# EAGLE design IC Adapter 2x1x24 (EAGLE 9.6.2)
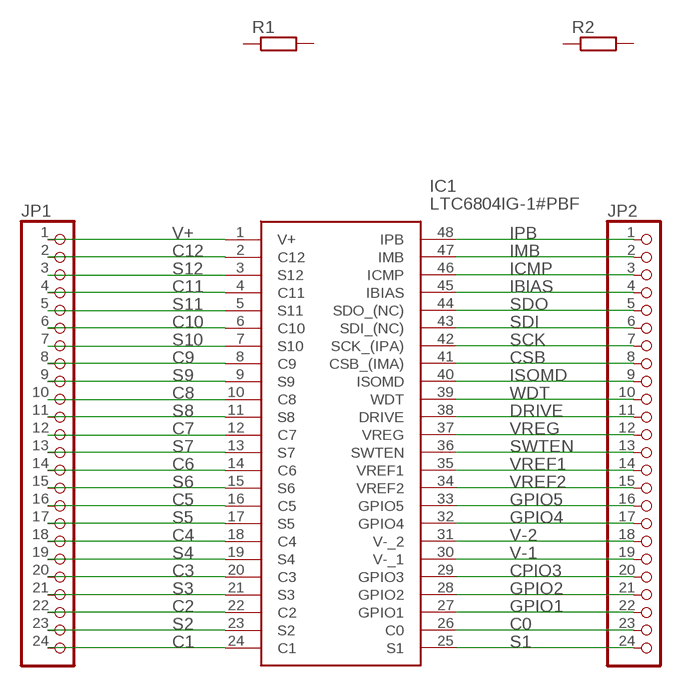
[diagram p0: schematic, sheet 1]

## Parts
IC1  LTC6804IG-1#PBF  [SOP50P780X200-48N]
JP1  PINHD-1X24  [1X24]
JP2  PINHD-1X24  [1X24]
R1  R-EU_R1210  [R1210]
R2  R-EU_R1210  [R1210]

## Nets
C0: IC1.26(C0) JP2.23
C1: IC1.24(C1) JP1.24
C2: IC1.22(C2) JP1.22
C3: IC1.20(C3) JP1.20
C4: IC1.18(C4) JP1.18
C5: IC1.16(C5) JP1.16
C6: IC1.14(C6) JP1.14
C7: IC1.12(C7) JP1.12
C8: IC1.10(C8) JP1.10
C9: IC1.8(C9) JP1.8
C10: IC1.6(C10) JP1.6
C11: IC1.4(C11) JP1.4
C12: IC1.2(C12) JP1.2
CPIO3: IC1.29(GPIO3) JP2.20
CSB: IC1.41(CSB_(IMA)) JP2.8
DRIVE: IC1.38(DRIVE) JP2.11
GPIO1: IC1.27(GPIO1) JP2.22
GPIO2: IC1.28(GPIO2) JP2.21
GPIO4: IC1.32(GPIO4) JP2.17
GPIO5: IC1.33(GPIO5) JP2.16
IBIAS: IC1.45(IBIAS) JP2.4
ICMP: IC1.46(ICMP) JP2.3
IMB: IC1.47(IMB) JP2.2
IPB: IC1.48(IPB) JP2.1
ISOMD: IC1.40(ISOMD) JP2.9
S1: IC1.25(S1) JP2.24
S2: IC1.23(S2) JP1.23
S3: IC1.21(S3) JP1.21
S4: IC1.19(S4) JP1.19
S5: IC1.17(S5) JP1.17
S6: IC1.15(S6) JP1.15
S7: IC1.13(S7) JP1.13
S8: IC1.11(S8) JP1.11
S9: IC1.9(S9) JP1.9
S10: IC1.7(S10) JP1.7
S11: IC1.5(S11) JP1.5
S12: IC1.3(S12) JP1.3
SCK: IC1.42(SCK_(IPA)) JP2.7
SDI: IC1.43(SDI_(NC)) JP2.6
SDO: IC1.44(SDO_(NC)) JP2.5
SWTEN: IC1.36(SWTEN) JP2.13
V+: IC1.1(V+) JP1.1
V-1: IC1.30(V-_1) JP2.19
V-2: IC1.31(V-_2) JP2.18
VREF1: IC1.35(VREF1) JP2.14
VREF2: IC1.34(VREF2) JP2.15
VREG: IC1.37(VREG) JP2.12
WDT: IC1.39(WDT) JP2.10
Unconnected: R1.1 R1.2 R2.1 R2.2

## Library data of the parts
IC1 = SamacSys_Parts:LTC6804IG-1#PBF: Multicell Battery Monitors, 0V - 5V Source: Datasheet <http://cds.linear.com/docs/en/datasheet/680412fb.pdf>; DESCRIPTION: Multicell Battery Monitors, 0V - 5V; HEIGHT: 2mm; MANUFACTURER_NAME: Linear Technology; MANUFACTURER_PART_NUMBER: LTC6804IG-1#PBF; MOUSER_PART_NUMBER: 584-LTC6804IG-1#PBF; MOUSER_PRICE-STOCK: https://www.mouser.co.uk/ProductDetail/Analog-Devices-Linear-Technology/LTC6804IG-1PBF?qs=hVkxg5c3xu%2FdtwBTq6c3xw%3D%3D
JP1 JP2 = pinhead:PINHD-1X24: PIN HEADER
R1 R2 = rcl:R-EU_: RESISTOR, European symbol

## Board
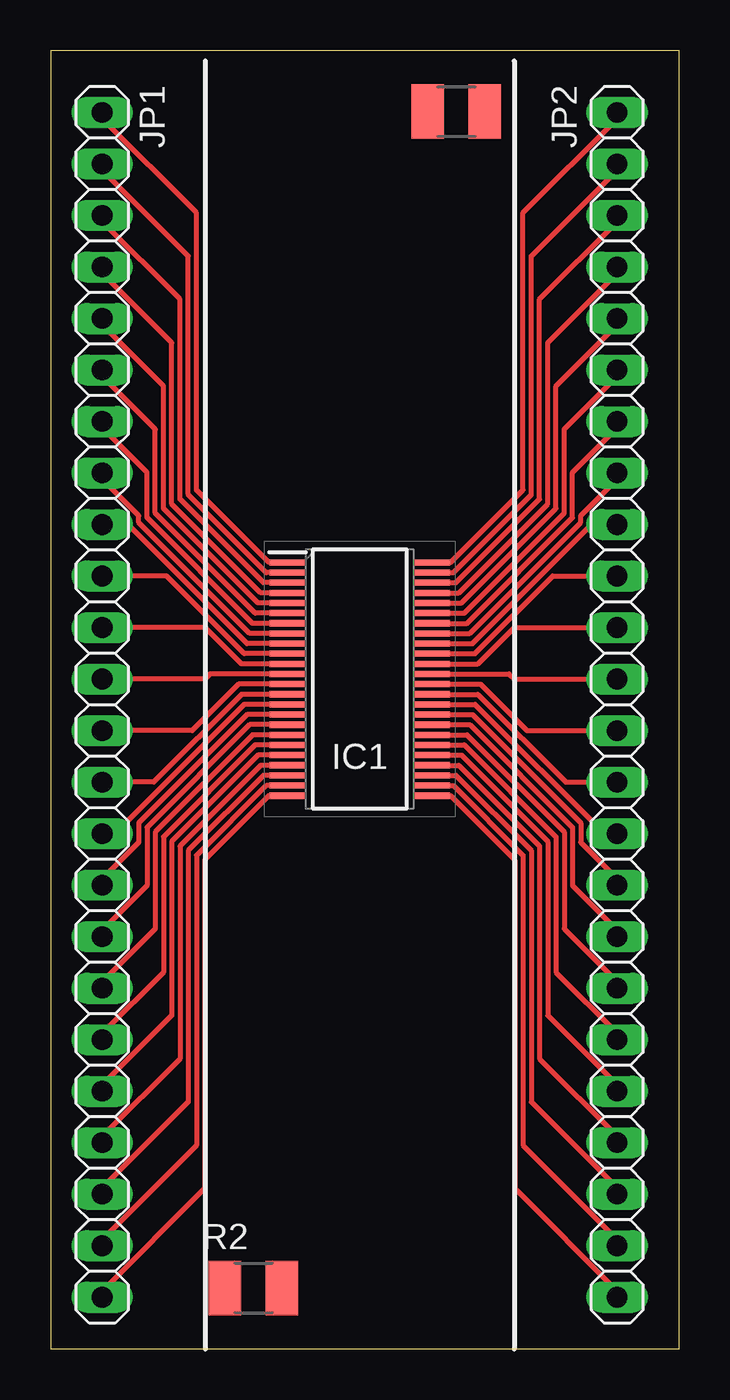
[diagram p1: board, top side]

Size 31 x 64 mm. Coordinates in mm from the lower left corner, seen from the top.
Outline: 0,0 31,0 31,64 0,64 0,0
Copper layers (1*16): Top 0.035mm / dielectric 1.5mm / Bottom 0.035mm
Design rules "default *": minimum track width 10mil, minimum drill 0.35mm, track to track 6mil, track to pad 6mil, pad to pad 6mil, via to via 6mil, smd to smd 6mil, copper to edge 40mil, drill to drill 6mil, minimum pad ring 10mil, minimum via ring 8mil, stop-mask expansion 4mil, vias tented up to drill 20mil, thermal gap 10mil

### Footprints (pad centres in the part's own frame; a part is rotated, then mirrored left to right if it is on the bottom)
SOP50P780X200-48N = smd 1.8 x 0.3: 1 -3.55,5.75; 2 -3.55,5.25; 3 -3.55,4.75; 4 -3.55,4.25; 5 -3.55,3.75; 6 -3.55,3.25; 7 -3.55,2.75; 8 -3.55,2.25; 9 -3.55,1.75; 10 -3.55,1.25; 11 -3.55,0.75; 12 -3.55,0.25; 13 -3.55,-0.25; 14 -3.55,-0.75; 15 -3.55,-1.25; 16 -3.55,-1.75; 17 -3.55,-2.25; 18 -3.55,-2.75; 19 -3.55,-3.25; 20 -3.55,-3.75; 21 -3.55,-4.25; 22 -3.55,-4.75; 23 -3.55,-5.25; 24 -3.55,-5.75; 25 3.55,-5.75; 26 3.55,-5.25; 27 3.55,-4.75; 28 3.55,-4.25; 29 3.55,-3.75; 30 3.55,-3.25; 31 3.55,-2.75; 32 3.55,-2.25; 33 3.55,-1.75; 34 3.55,-1.25; 35 3.55,-0.75; 36 3.55,-0.25; 37 3.55,0.25; 38 3.55,0.75; 39 3.55,1.25; 40 3.55,1.75; 41 3.55,2.25; 42 3.55,2.75; 43 3.55,3.25; 44 3.55,3.75; 45 3.55,4.25; 46 3.55,4.75; 47 3.55,5.25; 48 3.55,5.75
1X24 = drill 1.016 long: 1 -29.21,0; 2 -26.67,0; 3 -24.13,0; 4 -21.59,0; 5 -19.05,0; 6 -16.51,0; 7 -13.97,0; 8 -11.43,0; 9 -8.89,0; 10 -6.35,0; 11 -3.81,0; 12 -1.27,0; 13 1.27,0; 14 3.81,0; 15 6.35,0; 16 8.89,0; 17 11.43,0; 18 13.97,0; 19 16.51,0; 20 19.05,0; 21 21.59,0; 22 24.13,0; 23 26.67,0; 24 29.21,0
R1210 = smd 1.6 x 2.7: 1 -1.4,0; 2 1.4,0

### Placement (x,y rotation side)
IC1  15.24,33.02 0 top
JP1  2.54,31.75 270 top
JP2  27.94,31.75 270 top
R1  20,61 0 top
R2  10,3 0 top

### Tracks (layer width: path | path; a pad name or v marks a point on that pad's centre or on a via)
C0
  Top 0.254: IC1.26 19.86,27.77 23.29,24.33 23.29,10.03 27.94,5.38 JP2.23
C1
  Top 0.254: IC1.24 10.76,27.27 7.59,24.11 7.59,7.9 2.54,2.85 JP1.24
C2
  Top 0.254: IC1.22 10.49,28.27 6.78,24.56 6.78,12.17 2.54,7.92 JP1.22
C3
  Top 0.254: IC1.20 10.22,29.27 5.97,25.02 5.97,16.43 2.54,13.01 JP1.20
C4
  Top 0.254: IC1.18 9.95,30.27 5.16,25.48 5.16,20.7 2.54,18.09 JP1.18
C5
  Top 0.254: IC1.16 9.68,31.27 4.34,25.93 4.34,24.97 2.54,23.16 JP1.16
C6
  Top 0.254: IC1.14 9.41,32.27 5.08,27.94 JP1.14
C7
  Top 0.254: IC1.12 7.87,33.27 7.62,33.02 JP1.12
C8
  Top 0.254: IC1.10 9.54,34.27 5.71,38.1 JP1.10
C9
  Top 0.254: IC1.8 9.81,35.27 4.34,40.74 4.34,41.07 2.54,42.88 JP1.8
C10
  Top 0.254: IC1.6 10.09,36.27 5.16,41.2 5.16,45.34 2.54,47.95 JP1.6
C11
  Top 0.254: IC1.4 10.36,37.27 5.97,41.66 5.97,49.61 2.54,53.03 JP1.4
C12
  Top 0.254: IC1.2 10.62,38.27 6.78,42.11 6.78,53.87 2.54,58.12 JP1.2
CPIO3
  Top 0.254: IC1.29 20.26,29.27 24.51,25.02 24.51,16.43 27.94,13.01 JP2.20
CSB
  Top 0.254: IC1.41 20.66,35.27 26.14,40.74 26.14,41.07 27.94,42.88 JP2.8
DRIVE
  Top 0.254: IC1.38 21.07,33.77 22.86,35.56 JP2.11
GPIO1
  Top 0.254: IC1.27 19.99,28.27 23.7,24.56 23.7,12.17 27.94,7.92 JP2.22
GPIO2
  Top 0.254: IC1.28 20.12,28.77 24.11,24.79 24.11,14.3 27.94,10.46 JP2.21
GPIO4
  Top 0.254: IC1.32 20.66,30.77 25.73,25.7 25.73,22.84 27.94,20.62 JP2.17
GPIO5
  Top 0.254: IC1.33 20.8,31.27 26.14,25.93 26.14,24.97 27.94,23.16 JP2.16
IBIAS
  Top 0.254: IC1.45 20.12,37.27 24.51,41.66 24.51,49.61 27.94,53.03 JP2.4
ICMP
  Top 0.254: IC1.46 19.99,37.77 24.11,41.88 24.11,51.74 27.94,55.58 JP2.3
IMB
  Top 0.254: IC1.47 19.86,38.27 23.7,42.11 23.7,53.87 27.94,58.12 JP2.2
IPB
  Top 0.254: IC1.48 19.72,38.77 23.29,42.34 23.29,56.01 27.94,60.66 JP2.1
ISOMD
  Top 0.254: IC1.40 20.8,34.77 26.67,40.64 JP2.9
S1
  Top 0.254: IC1.25 19.72,27.27 22.89,24.11 22.89,7.9 27.94,2.85 JP2.24
S2
  Top 0.254: IC1.23 10.62,27.77 7.19,24.33 7.19,10.03 2.54,5.38 JP1.23
S3
  Top 0.254: IC1.21 10.36,28.77 6.38,24.79 6.38,14.3 2.54,10.46 JP1.21
S4
  Top 0.254: IC1.19 10.09,29.77 5.56,25.25 5.56,18.57 2.54,15.54 JP1.19
S5
  Top 0.254: IC1.17 9.81,30.77 4.75,25.7 4.75,22.84 2.54,20.62 JP1.17
S6
  Top 0.254: IC1.15 9.54,31.77 3.17,25.4 JP1.15
S7
  Top 0.254: IC1.13 9.28,32.77 6.99,30.48 JP1.13
S8
  Top 0.254: IC1.11 9.41,33.77 7.62,35.56 JP1.11
S9
  Top 0.254: IC1.9 9.68,34.77 3.81,40.64 JP1.9
S10
  Top 0.254: IC1.7 9.95,35.77 4.75,40.97 4.75,43.2 2.54,45.41 JP1.7
S11
  Top 0.254: IC1.5 10.22,36.77 5.56,41.43 5.56,47.47 2.54,50.49 JP1.5
S12
  Top 0.254: IC1.3 10.49,37.77 6.38,41.88 6.38,51.74 2.54,55.58 JP1.3
SCK
  Top 0.254: IC1.42 20.53,35.77 25.73,40.97 25.73,43.2 27.94,45.41 JP2.7
SDI
  Top 0.254: IC1.43 20.39,36.27 25.32,41.2 25.32,45.34 27.94,47.95 JP2.6
SDO
  Top 0.254: IC1.44 20.26,36.77 24.92,41.43 24.92,47.47 27.94,50.49 JP2.5
SWTEN
  Top 0.254: IC1.36 21.2,32.77 23.5,30.48 JP2.13
V+
  Top 0.254: IC1.1 10.76,38.77 7.19,42.34 7.19,56.01 2.54,60.66 JP1.1
V-1
  Top 0.254: IC1.30 20.39,29.77 24.92,25.25 24.92,18.57 27.94,15.54 JP2.19
V-2
  Top 0.254: IC1.31 20.53,30.27 25.32,25.48 25.32,20.7 27.94,18.09 JP2.18
VREF1
  Top 0.254: IC1.35 21.07,32.27 25.4,27.94 JP2.14
VREF2
  Top 0.254: IC1.34 20.93,31.77 27.3,25.4 JP2.15
VREG
  Top 0.254: IC1.37 22.61,33.27 22.86,33.02 JP2.12
WDT
  Top 0.254: IC1.39 20.93,34.27 24.77,38.1 JP2.10